# Altium project Ejemplo7.PrjPcb
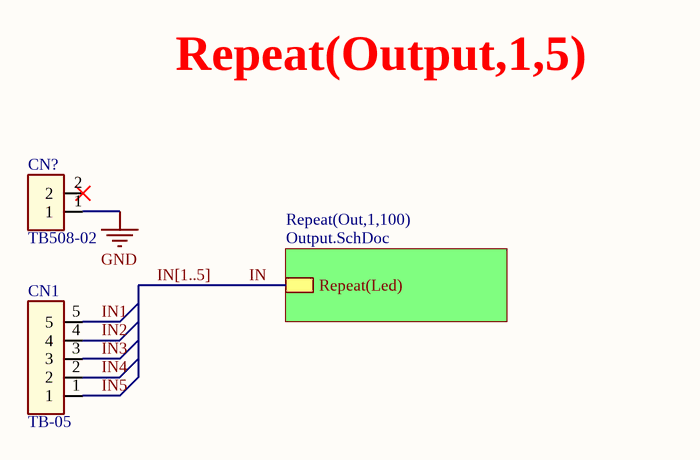
[diagram p0: Sheet2.SchDoc]
2 sheets, 202 parts. Net scope: hierarchical (ports join the sheet entries above them; power ports are global).
Board file: PCB2.PcbDoc
Sheets:
  Sheet2.SchDoc
    Out1 = Output.SchDoc
    Out2 = Output.SchDoc
    Out3 = Output.SchDoc
    Out4 = Output.SchDoc
    Out5 = Output.SchDoc
    Out6 = Output.SchDoc
    Out7 = Output.SchDoc
    Out8 = Output.SchDoc
    Out9 = Output.SchDoc
    Out10 = Output.SchDoc
    Out11 = Output.SchDoc
    Out12 = Output.SchDoc
    Out13 = Output.SchDoc
    Out14 = Output.SchDoc
    Out15 = Output.SchDoc
    Out16 = Output.SchDoc
    Out17 = Output.SchDoc
    Out18 = Output.SchDoc
    Out19 = Output.SchDoc
    Out20 = Output.SchDoc
    Out21 = Output.SchDoc
    Out22 = Output.SchDoc
    Out23 = Output.SchDoc
    Out24 = Output.SchDoc
    Out25 = Output.SchDoc
    Out26 = Output.SchDoc
    Out27 = Output.SchDoc
    Out28 = Output.SchDoc
    Out29 = Output.SchDoc
    Out30 = Output.SchDoc
    Out31 = Output.SchDoc
    Out32 = Output.SchDoc
    Out33 = Output.SchDoc
    Out34 = Output.SchDoc
    Out35 = Output.SchDoc
    Out36 = Output.SchDoc
    Out37 = Output.SchDoc
    Out38 = Output.SchDoc
    Out39 = Output.SchDoc
    Out40 = Output.SchDoc
    Out41 = Output.SchDoc
    Out42 = Output.SchDoc
    Out43 = Output.SchDoc
    Out44 = Output.SchDoc
    Out45 = Output.SchDoc
    Out46 = Output.SchDoc
    Out47 = Output.SchDoc
    Out48 = Output.SchDoc
    Out49 = Output.SchDoc
    Out50 = Output.SchDoc
    Out51 = Output.SchDoc
    Out52 = Output.SchDoc
    Out53 = Output.SchDoc
    Out54 = Output.SchDoc
    Out55 = Output.SchDoc
    Out56 = Output.SchDoc
    Out57 = Output.SchDoc
    Out58 = Output.SchDoc
    Out59 = Output.SchDoc
    Out60 = Output.SchDoc
    Out61 = Output.SchDoc
    Out62 = Output.SchDoc
    Out63 = Output.SchDoc
    Out64 = Output.SchDoc
    Out65 = Output.SchDoc
    Out66 = Output.SchDoc
    Out67 = Output.SchDoc
    Out68 = Output.SchDoc
    Out69 = Output.SchDoc
    Out70 = Output.SchDoc
    Out71 = Output.SchDoc
    Out72 = Output.SchDoc
    Out73 = Output.SchDoc
    Out74 = Output.SchDoc
    Out75 = Output.SchDoc
    Out76 = Output.SchDoc
    Out77 = Output.SchDoc
    Out78 = Output.SchDoc
    Out79 = Output.SchDoc
    Out80 = Output.SchDoc
    Out81 = Output.SchDoc
    Out82 = Output.SchDoc
    Out83 = Output.SchDoc
    Out84 = Output.SchDoc
    Out85 = Output.SchDoc
    Out86 = Output.SchDoc
    Out87 = Output.SchDoc
    Out88 = Output.SchDoc
    Out89 = Output.SchDoc
    Out90 = Output.SchDoc
    Out91 = Output.SchDoc
    Out92 = Output.SchDoc
    Out93 = Output.SchDoc
    Out94 = Output.SchDoc
    Out95 = Output.SchDoc
    Out96 = Output.SchDoc
    Out97 = Output.SchDoc
    Out98 = Output.SchDoc
    Out99 = Output.SchDoc
    Out100 = Output.SchDoc

## Sheet Sheet2.SchDoc
size A4; SheetNumber: 1; SheetTotal: 2

### Parts
CN1  TB-05  [TB508-05]
CN?  TB508-02  [TB508-02]

### Sub-sheets
Repeat(Out,1,100) = Output.SchDoc: Repeat(Led)

### Nets
GND: CN?.1
IN: sheet Repeat(Out,1,100)/Repeat(Led)
IN1: CN1.5
IN2: CN1.4
IN3: CN1.3
IN4: CN1.2
IN5: CN1.1

Not connected (* = marked no-connect by the designer): CN? 2*

### Buses and harness runs
bus IN[1..5]

### Notes on the sheet
- Repeat(Output,1,5)

### Library data of the parts
CN1 = TB-05: Terminal Block; Manufacturer: *; Part number: *; Unit price: *; Value: TB-05
CN? = TB-02: Terminal Block; Manufacturer: *; Part number: *; Unit price: *; Value: TB508-02

## Sheet Output.SchDoc
size A4; SheetNumber: 2; SheetTotal: 2
Used 100 times, as channels Out1, Out2, Out3, Out4, Out5, Out6, Out7, Out8, Out9, Out10, Out11, Out12, Out13, Out14, Out15, Out16, Out17, Out18, Out19, Out20, Out21, Out22, Out23, Out24, Out25, Out26, Out27, Out28, Out29, Out30, Out31, Out32, Out33, Out34, Out35, Out36, Out37, Out38, Out39, Out40, Out41, Out42, Out43, Out44, Out45, Out46, Out47, Out48, Out49, Out50, Out51, Out52, Out53, Out54, Out55, Out56, Out57, Out58, Out59, Out60, Out61, Out62, Out63, Out64, Out65, Out66, Out67, Out68, Out69, Out70, Out71, Out72, Out73, Out74, Out75, Out76, Out77, Out78, Out79, Out80, Out81, Out82, Out83, Out84, Out85, Out86, Out87, Out88, Out89, Out90, Out91, Out92, Out93, Out94, Out95, Out96, Out97, Out98, Out99, Out100. Parts and nets are listed once, with the designators drawn on the sheet.
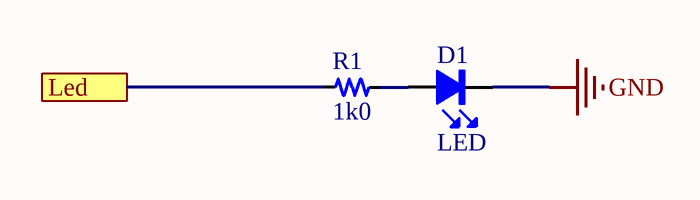
[diagram p1: Output.SchDoc]

### Parts
D1  LED  [LED-0805]
R1  1k0  [R0805]

### Ports
Led

### Nets
GND: D1.1
Led: R1.2 ; port Led
NetD1_2: D1.2 R1.1

### Channels
Out1: designators end in _Out1; ports Led=IN1
Out2: designators end in _Out2; ports Led=IN2
Out3: designators end in _Out3; ports Led=IN3
Out4: designators end in _Out4; ports Led=IN4
Out5: designators end in _Out5; ports Led=IN5
Out6: designators end in _Out6; ports Led=IN6
Out7: designators end in _Out7; ports Led=IN7
Out8: designators end in _Out8; ports Led=IN8
Out9: designators end in _Out9; ports Led=IN9
Out10: designators end in _Out10; ports Led=IN10
Out11: designators end in _Out11; ports Led=IN11
Out12: designators end in _Out12; ports Led=IN12
Out13: designators end in _Out13; ports Led=IN13
Out14: designators end in _Out14; ports Led=IN14
Out15: designators end in _Out15; ports Led=IN15
Out16: designators end in _Out16; ports Led=IN16
Out17: designators end in _Out17; ports Led=IN17
Out18: designators end in _Out18; ports Led=IN18
Out19: designators end in _Out19; ports Led=IN19
Out20: designators end in _Out20; ports Led=IN20
Out21: designators end in _Out21; ports Led=IN21
Out22: designators end in _Out22; ports Led=IN22
Out23: designators end in _Out23; ports Led=IN23
Out24: designators end in _Out24; ports Led=IN24
Out25: designators end in _Out25; ports Led=IN25
Out26: designators end in _Out26; ports Led=IN26
Out27: designators end in _Out27; ports Led=IN27
Out28: designators end in _Out28; ports Led=IN28
Out29: designators end in _Out29; ports Led=IN29
Out30: designators end in _Out30; ports Led=IN30
Out31: designators end in _Out31; ports Led=IN31
Out32: designators end in _Out32; ports Led=IN32
Out33: designators end in _Out33; ports Led=IN33
Out34: designators end in _Out34; ports Led=IN34
Out35: designators end in _Out35; ports Led=IN35
Out36: designators end in _Out36; ports Led=IN36
Out37: designators end in _Out37; ports Led=IN37
Out38: designators end in _Out38; ports Led=IN38
Out39: designators end in _Out39; ports Led=IN39
Out40: designators end in _Out40; ports Led=IN40
Out41: designators end in _Out41; ports Led=IN41
Out42: designators end in _Out42; ports Led=IN42
Out43: designators end in _Out43; ports Led=IN43
Out44: designators end in _Out44; ports Led=IN44
Out45: designators end in _Out45; ports Led=IN45
Out46: designators end in _Out46; ports Led=IN46
Out47: designators end in _Out47; ports Led=IN47
Out48: designators end in _Out48; ports Led=IN48
Out49: designators end in _Out49; ports Led=IN49
Out50: designators end in _Out50; ports Led=IN50
Out51: designators end in _Out51; ports Led=IN51
Out52: designators end in _Out52; ports Led=IN52
Out53: designators end in _Out53; ports Led=IN53
Out54: designators end in _Out54; ports Led=IN54
Out55: designators end in _Out55; ports Led=IN55
Out56: designators end in _Out56; ports Led=IN56
Out57: designators end in _Out57; ports Led=IN57
Out58: designators end in _Out58; ports Led=IN58
Out59: designators end in _Out59; ports Led=IN59
Out60: designators end in _Out60; ports Led=IN60
Out61: designators end in _Out61; ports Led=IN61
Out62: designators end in _Out62; ports Led=IN62
Out63: designators end in _Out63; ports Led=IN63
Out64: designators end in _Out64; ports Led=IN64
Out65: designators end in _Out65; ports Led=IN65
Out66: designators end in _Out66; ports Led=IN66
Out67: designators end in _Out67; ports Led=IN67
Out68: designators end in _Out68; ports Led=IN68
Out69: designators end in _Out69; ports Led=IN69
Out70: designators end in _Out70; ports Led=IN70
Out71: designators end in _Out71; ports Led=IN71
Out72: designators end in _Out72; ports Led=IN72
Out73: designators end in _Out73; ports Led=IN73
Out74: designators end in _Out74; ports Led=IN74
Out75: designators end in _Out75; ports Led=IN75
Out76: designators end in _Out76; ports Led=IN76
Out77: designators end in _Out77; ports Led=IN77
Out78: designators end in _Out78; ports Led=IN78
Out79: designators end in _Out79; ports Led=IN79
Out80: designators end in _Out80; ports Led=IN80
Out81: designators end in _Out81; ports Led=IN81
Out82: designators end in _Out82; ports Led=IN82
Out83: designators end in _Out83; ports Led=IN83
Out84: designators end in _Out84; ports Led=IN84
Out85: designators end in _Out85; ports Led=IN85
Out86: designators end in _Out86; ports Led=IN86
Out87: designators end in _Out87; ports Led=IN87
Out88: designators end in _Out88; ports Led=IN88
Out89: designators end in _Out89; ports Led=IN89
Out90: designators end in _Out90; ports Led=IN90
Out91: designators end in _Out91; ports Led=IN91
Out92: designators end in _Out92; ports Led=IN92
Out93: designators end in _Out93; ports Led=IN93
Out94: designators end in _Out94; ports Led=IN94
Out95: designators end in _Out95; ports Led=IN95
Out96: designators end in _Out96; ports Led=IN96
Out97: designators end in _Out97; ports Led=IN97
Out98: designators end in _Out98; ports Led=IN98
Out99: designators end in _Out99; ports Led=IN99
Out100: designators end in _Out100; ports Led=IN100

### Library data of the parts
D1 = LED: LED - Light-Emitting Diode; Manufacturer: *; Part number: *; Unit price: *; Value: LED
R1 = Resistor: Single resistor; Power: 0.125W; Manufacturer: *; Part number: *; Value: 1k0; Unit price: 0.1

## Nets that join several sheets
GND: Sheet2 (CN?.1), Out1 (D1_Out1.1), Out2 (D1_Out2.1), Out3 (D1_Out3.1), Out4 (D1_Out4.1), Out5 (D1_Out5.1), Out6 (D1_Out6.1), Out7 (D1_Out7.1), Out8 (D1_Out8.1), Out9 (D1_Out9.1), Out10 (D1_Out10.1), Out11 (D1_Out11.1), Out12 (D1_Out12.1), Out13 (D1_Out13.1), Out14 (D1_Out14.1), Out15 (D1_Out15.1), Out16 (D1_Out16.1), Out17 (D1_Out17.1), Out18 (D1_Out18.1), Out19 (D1_Out19.1), Out20 (D1_Out20.1), Out21 (D1_Out21.1), Out22 (D1_Out22.1), Out23 (D1_Out23.1), Out24 (D1_Out24.1), Out25 (D1_Out25.1), Out26 (D1_Out26.1), Out27 (D1_Out27.1), Out28 (D1_Out28.1), Out29 (D1_Out29.1), Out30 (D1_Out30.1), Out31 (D1_Out31.1), Out32 (D1_Out32.1), Out33 (D1_Out33.1), Out34 (D1_Out34.1), Out35 (D1_Out35.1), Out36 (D1_Out36.1), Out37 (D1_Out37.1), Out38 (D1_Out38.1), Out39 (D1_Out39.1), Out40 (D1_Out40.1), Out41 (D1_Out41.1), Out42 (D1_Out42.1), Out43 (D1_Out43.1), Out44 (D1_Out44.1), Out45 (D1_Out45.1), Out46 (D1_Out46.1), Out47 (D1_Out47.1), Out48 (D1_Out48.1), Out49 (D1_Out49.1), Out50 (D1_Out50.1), Out51 (D1_Out51.1), Out52 (D1_Out52.1), Out53 (D1_Out53.1), Out54 (D1_Out54.1), Out55 (D1_Out55.1), Out56 (D1_Out56.1), Out57 (D1_Out57.1), Out58 (D1_Out58.1), Out59 (D1_Out59.1), Out60 (D1_Out60.1), Out61 (D1_Out61.1), Out62 (D1_Out62.1), Out63 (D1_Out63.1), Out64 (D1_Out64.1), Out65 (D1_Out65.1), Out66 (D1_Out66.1), Out67 (D1_Out67.1), Out68 (D1_Out68.1), Out69 (D1_Out69.1), Out70 (D1_Out70.1), Out71 (D1_Out71.1), Out72 (D1_Out72.1), Out73 (D1_Out73.1), Out74 (D1_Out74.1), Out75 (D1_Out75.1), Out76 (D1_Out76.1), Out77 (D1_Out77.1), Out78 (D1_Out78.1), Out79 (D1_Out79.1), Out80 (D1_Out80.1), Out81 (D1_Out81.1), Out82 (D1_Out82.1), Out83 (D1_Out83.1), Out84 (D1_Out84.1), Out85 (D1_Out85.1), Out86 (D1_Out86.1), Out87 (D1_Out87.1), Out88 (D1_Out88.1), Out89 (D1_Out89.1), Out90 (D1_Out90.1), Out91 (D1_Out91.1), Out92 (D1_Out92.1), Out93 (D1_Out93.1), Out94 (D1_Out94.1), Out95 (D1_Out95.1), Out96 (D1_Out96.1), Out97 (D1_Out97.1), Out98 (D1_Out98.1), Out99 (D1_Out99.1), Out100 (D1_Out100.1)
IN1: Sheet2 (CN1.5), Out1 (R1_Out1.2)
IN2: Sheet2 (CN1.4), Out2 (R1_Out2.2)
IN3: Sheet2 (CN1.3), Out3 (R1_Out3.2)
IN4: Sheet2 (CN1.2), Out4 (R1_Out4.2)
IN5: Sheet2 (CN1.1), Out5 (R1_Out5.2)